# EAGLE design esp8266-rgb-ledstrip (EAGLE 7.2.0)
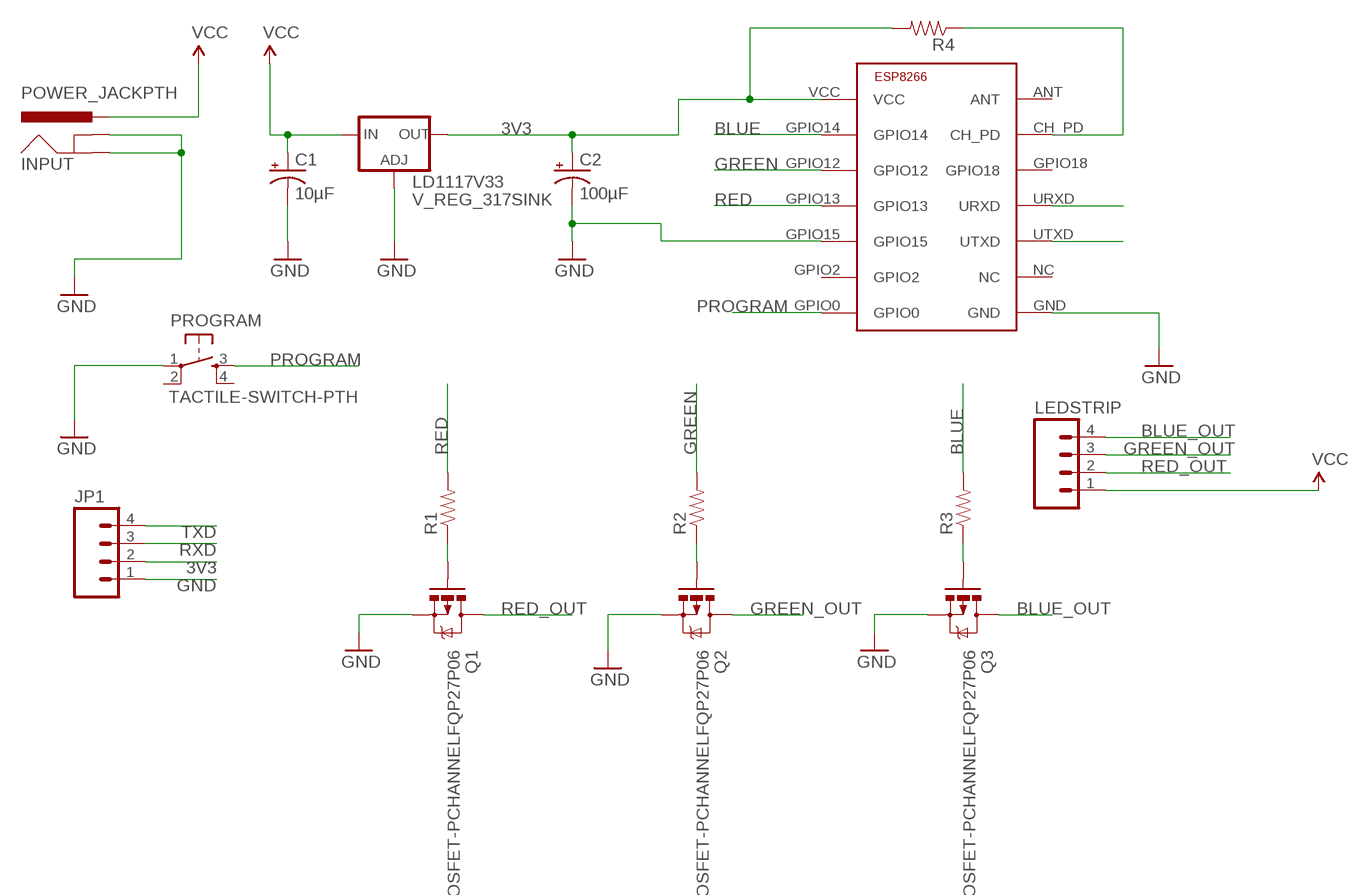
[diagram p0: schematic, sheet 1]

## Parts
C1  10µF  CAP_POLPTH2  [CPOL-RADIAL-10UF-25V]
C2  100µF  CAP_POLPTH1  [CPOL-RADIAL-100UF-25V]
INPUT  POWER_JACKPTH  [POWER_JACK_PTH]
JP1  M04PTH  [1X04]
LD1117V33  V_REG_317SINK  [TO220-ADJ]
LEDSTRIP  M04PTH  [1X04]
PROGRAM  TACTILE-SWITCH-PTH  [TAC-SWITCH-PTH]
Q1  MOSFET-PCHANNELFQP27P06  [TO220V]
Q2  MOSFET-PCHANNELFQP27P06  [TO220V]
Q3  MOSFET-PCHANNELFQP27P06  [TO220V]
R1  RESISTORAXIAL-0.3  [AXIAL-0.3]
R2  RESISTORAXIAL-0.3  [AXIAL-0.3]
R3  RESISTORAXIAL-0.3  [AXIAL-0.3]
R4  RESISTORAXIAL-0.3  [AXIAL-0.3]
U$1  ESP8266-03  [ESP-03]

## Nets
3V3: C2.1(+) JP1.2 LD1117V33.OUT R4.P$2 U$1.VCC
BLUE: R3.P$2 U$1.GPIO14
BLUE_OUT: LEDSTRIP.4 Q3.2(D)
BLUE_R: Q3.1(G) R3.P$1
GND: C1.2(-) C2.2(-) INPUT.GND INPUT.GNDBREAK JP1.1 LD1117V33.ADJ PROGRAM.1 Q1.3(S) Q2.3(S) Q3.3(S) U$1.GND U$1.GPIO15
GREEN: R2.P$2 U$1.GPIO12
GREEN_OUT: LEDSTRIP.3 Q2.2(D)
GREEN_R: Q2.1(G) R2.P$1
N$1: R4.P$1 U$1.CH_PD
PROGRAM: PROGRAM.3 U$1.GPIO0
RED: R1.P$2 U$1.GPIO13
RED_OUT: LEDSTRIP.2 Q1.2(D)
RED_R: Q1.1(G) R1.P$1
RXD: JP1.3 U$1.URXD
TXD: JP1.4 U$1.UTXD
VCC: C1.1(+) INPUT.PWR LD1117V33.IN LEDSTRIP.1
Unconnected: PROGRAM.2 PROGRAM.4 U$1.ANT U$1.GPIO2 U$1.GPIO18 U$1.NC

## Library data of the parts
C1 C2 = SparkFun-Capacitors:CAP_POL: Capacitor Polarized These are standard SMD and PTH capacitors. Normally 10uF, 47uF, and 100uF in electrolytic and tantalum varieties. Always verify the external diameter of the through hole cap, it varies with capacity, voltage, and manufacturer. The EIA devices should be standard.
INPUT = SparkFun-Connectors:POWER_JACK: Power Jack This is the standard 5.5mm barrel jack for power. The PTH is the most common, proven, reliable, footprint. The Slot footprint only works if the mill layer is transmitted to the PCB fab house so be warned. Mating wall wart : TOL-00298 (and others); PROD_ID: CONN-08197
JP1 LEDSTRIP = SparkFun-Connectors:M04: Header 4 Standard 4-pin 0.1" header. Use with straight break away headers (SKU : PRT-00116), right angle break away headers (PRT-00553), swiss pins (PRT-00743), machine pins (PRT-00117), and female headers (PRT-00115). Molex polarized connector foot print use with SKU : PRT-08231 with associated crimp pins and housings. 1MM SMD Version SKU: PRT-10208
LD1117V33 = SparkFun-PowerIC:V_REG_317: Voltage Regulator Standard LM317 adjustable voltage regulator. AOI (Adjust Output Input). Google 'LM317 Calculator' for easy to use app to get the two resistor values needed. 240/720 for 5V output. 240/390 for 3.3V output. Spark Fun Electronics SKU : COM-00527
PROGRAM = GeekAmmo:TACTILE-SWITCH: Tactile Switch 4 Pins, SPST NO
Q1-Q3 = SparkFun-DiscreteSemi:MOSFET-PCHANNEL: Generic PMOSFET IRLML2244 - TRANS-11153 (SOT-23 -20V -4.3A) (1.Gate 2.Source 3.Drain) FQP27P06 - COM-10349 <http://www.sparkfun.com/products/10349> (TO-220 -60V -27A) (1.Gate 2.Source 3.Drain)
R1-R4 = SparkFun-Passives:RESISTOR: Resistor Basic schematic elements and footprints for 0603, 1206, and PTH resistors.
U$1 = #ESP8266:ESP8266-03: ESP8266 - ESP-03 Module

## Board
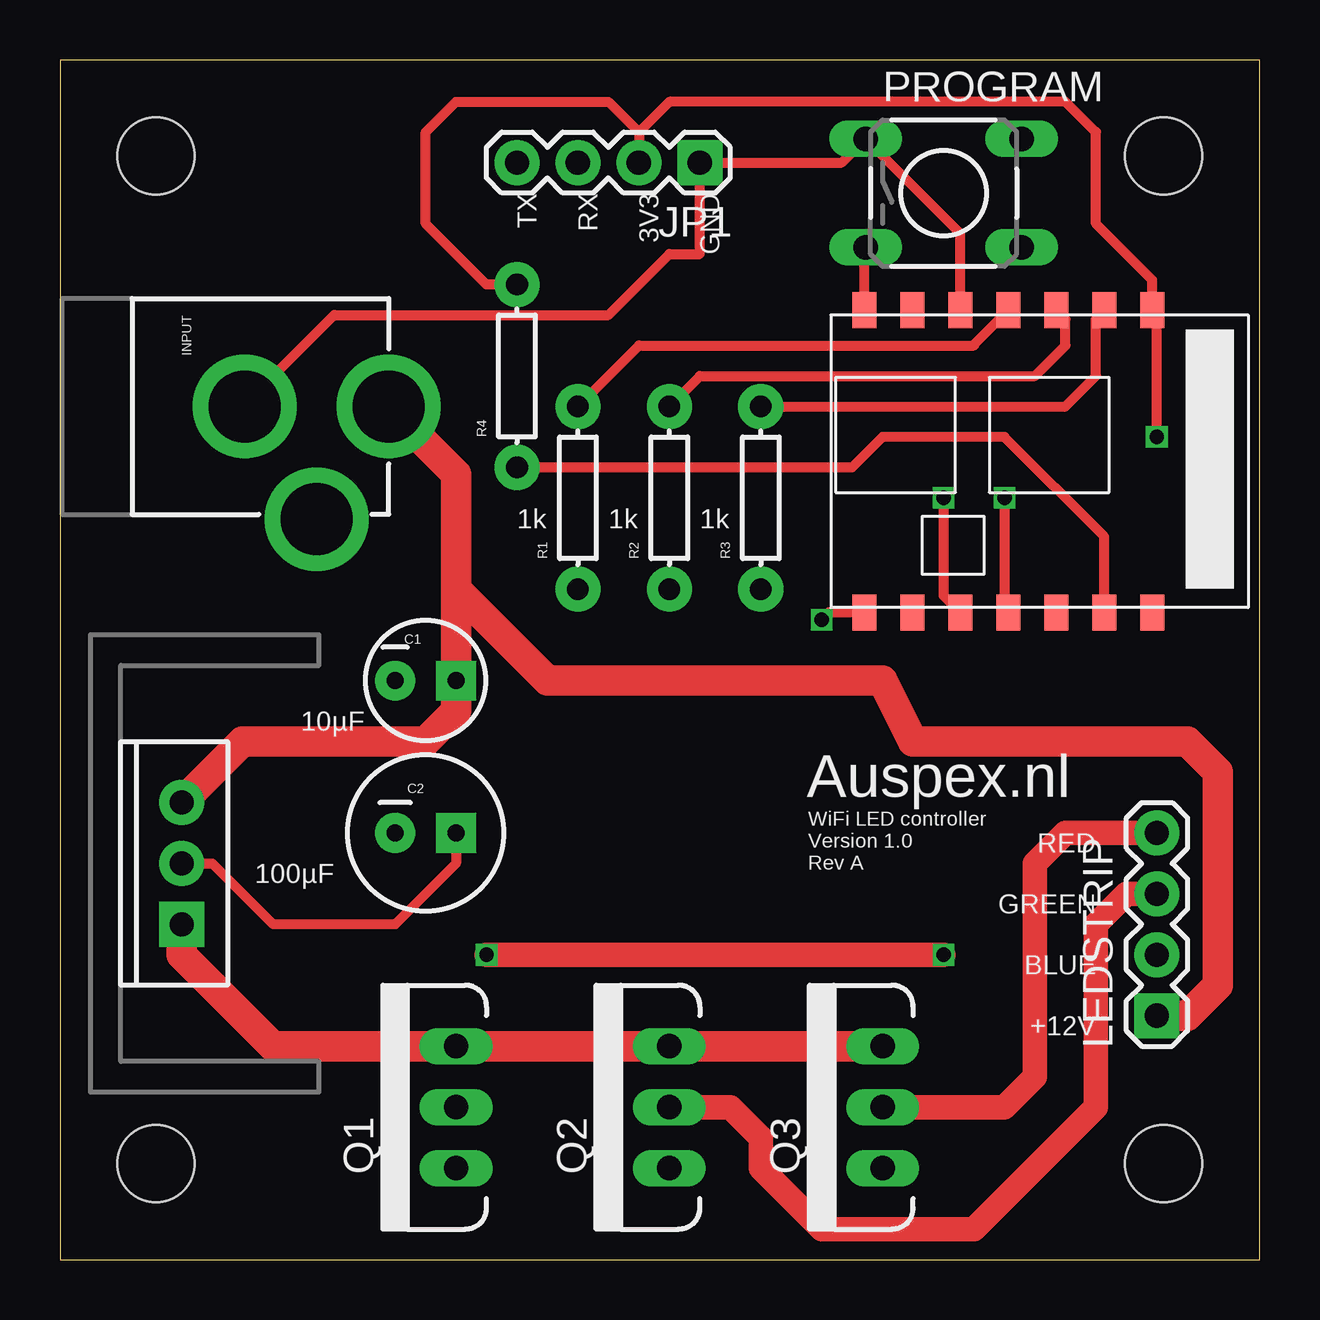
[diagram p1: board, top side]
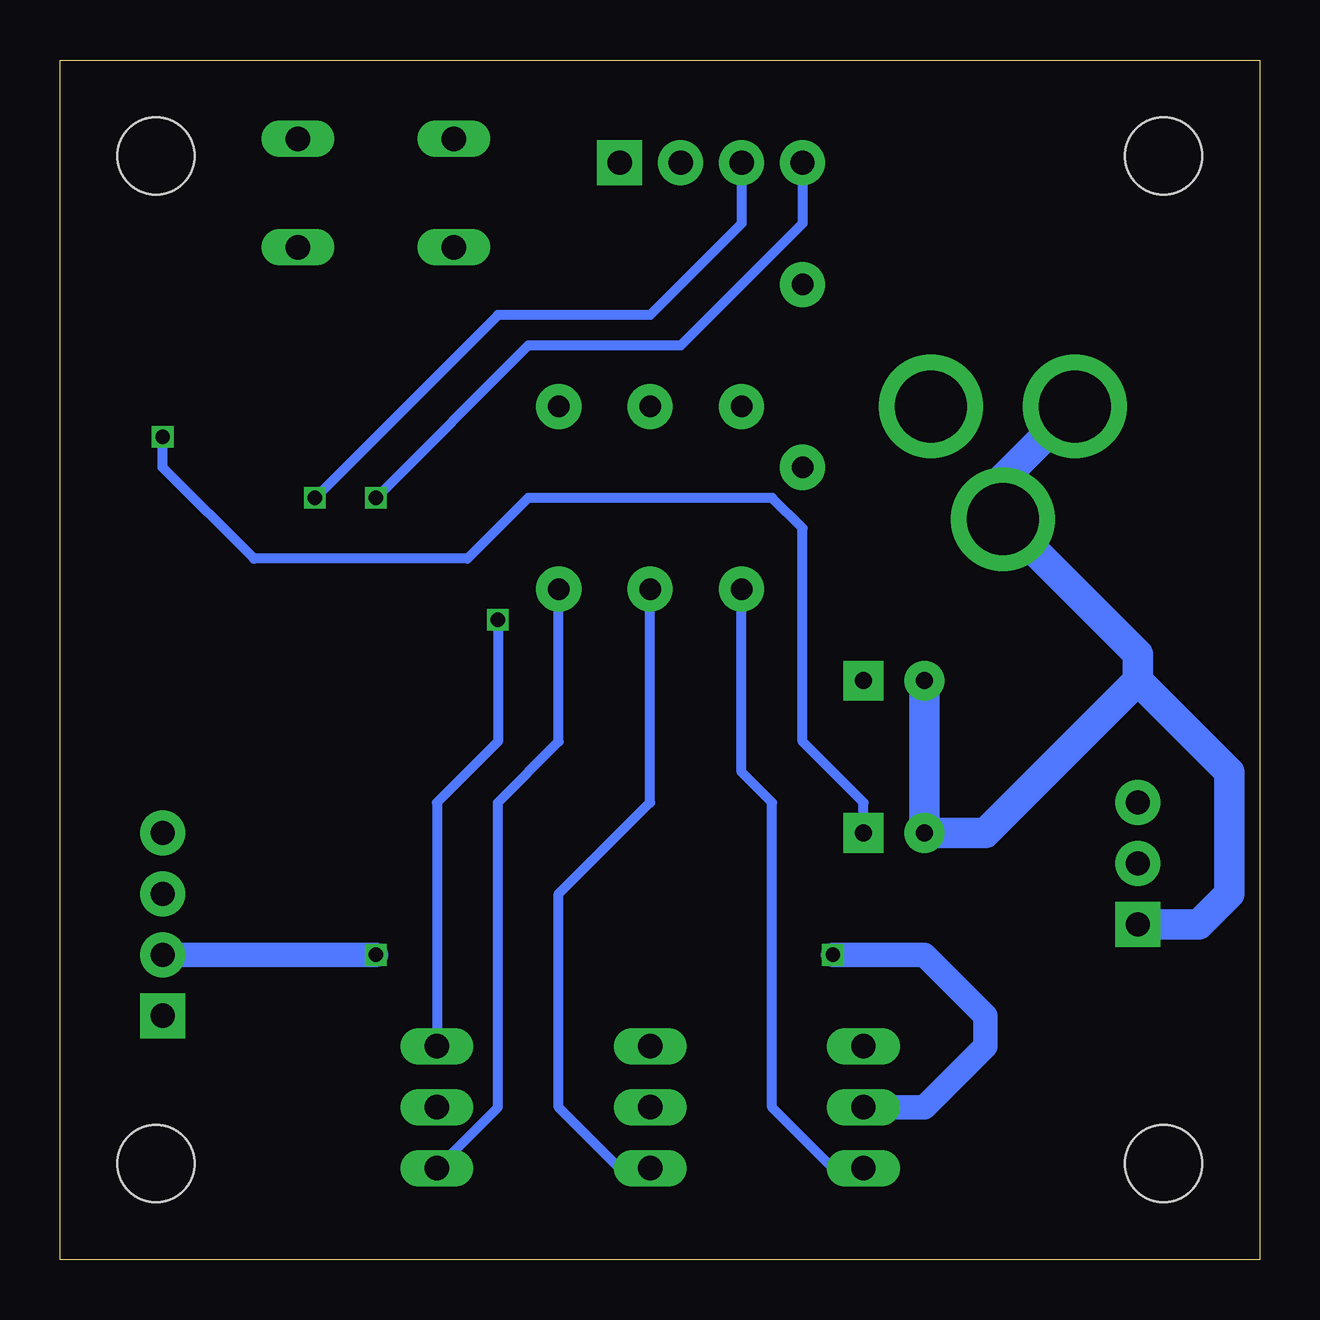
[diagram p2: board, bottom side, seen from below]

Size 50 x 50 mm. Coordinates in mm from the lower left corner, seen from the top.
Outline: 0,0 50,0 50,50 0,50 0,0
Copper layers (1*16): Top 0.035mm / dielectric 1.5mm / Bottom 0.035mm
Design rules "dirt_cheap_dirty_boards.v1": minimum track width 5mil, minimum drill 12mil, track to track 5mil, track to pad 5mil, pad to pad 5mil, via to via 5mil, smd to smd 0mil, copper to edge 10mil, drill to drill 10mil, minimum pad ring 10mil, minimum via ring 6mil, stop-mask expansion 2mil, vias tented up to drill 25mil, thermal gap 10mil
Holes 3.2 mm at 4,46 46,46 46,4 4,4

### Footprints (pad centres in the part's own frame; a part is rotated, then mirrored left to right if it is on the bottom)
CPOL-RADIAL-10UF-25V = drill 0.7 pad 1.651 square: 1 1.27,0 | drill 0.7 pad 1.651: 2 -1.27,0
CPOL-RADIAL-100UF-25V = drill 0.7 pad 1.651 square: 1 1.27,0 | drill 0.7 pad 1.651: 2 -1.27,0
POWER_JACK_PTH = drill 2.997 pad 4.318: GND 0,7.7; GNDBREAK 4.7,10.7; PWR 0,13.7
1X04 = drill 1.016 pad 1.88 square: 1 0,0 | drill 1.016 pad 1.88: 2 2.54,0; 3 5.08,0; 4 7.62,0
TO220-ADJ = drill 1 pad 1.88 square: ADJ -2.54,0 | drill 1 pad 1.88: IN 2.54,0; OUT 0,0
TAC-SWITCH-PTH = drill 1.016 pad 1.524 long: 1 -3.251,2.261; 2 3.251,2.261; 3 -3.251,-2.261; 4 3.251,-2.261
TO220V = drill 1.016 long: 1 -2.54,0; 2 0,0; 3 2.54,0
AXIAL-0.3 = drill 0.9 pad 1.88: P$1 -3.81,0; P$2 3.81,0
ESP-03 = smd 1 x 1.5: ANT 4,12.4; CH_PD 6,12.4; GND 16,12.4; GPIO0 16,-0.2; GPIO2 14,-0.2; GPIO12 8,-0.2; GPIO13 10,-0.2; GPIO14 6,-0.2; GPIO15 12,-0.2; GPIO18 8,12.4; NC 14,12.4; URXD 10,12.4; UTXD 12,12.4; VCC 4,-0.2

### Placement (x,y rotation side)
C1  15.24,24.13 0 top
C2  15.24,17.78 0 top
INPUT  0,35.56 270 top
JP1  26.67,45.72 180 top
LD1117V33  5.08,16.51 90 top
LEDSTRIP  45.72,10.16 90 top
PROGRAM  36.83,44.45 0 top
Q1  16.51,6.35 90 top
Q2  25.4,6.35 90 top
Q3  34.29,6.35 90 top
R1  21.59,31.75 90 top
R2  25.4,31.75 90 top
R3  29.21,31.75 90 top
R4  19.05,36.83 90 top
U$1  49.53,39.37 180 top

### Tracks (layer width: path | path; a pad name or v marks a point on that pad's centre or on a via)
3V3  (via drill 0.6)
  Top 0.406: LD1117V33.OUT 6.35,16.51 8.89,13.97 13.97,13.97 16.51,16.51 C2.1 | 24.13,46.99 25.4,48.26 41.91,48.26 43.18,46.99 43.18,43.18 45.53,40.83 U$1.VCC 45.72,39.38 v45.72,34.29 | 24.13,46.99 JP1.2 | R4.P$2 17.78,40.64 15.24,43.18 15.24,46.99 16.51,48.26 22.86,48.26 24.13,46.99
  Bottom 0.406: C2.1 16.51,19.05 19.05,21.59 19.05,30.48 20.32,31.75 30.48,31.75 33.02,29.21 41.91,29.21 45.72,33.02 v45.72,34.29
BLUE
  Top 0.406: R3.P$2 41.91,35.56 43.18,36.83 43.18,39.22 U$1.GPIO14
BLUE_OUT
  Top 1.016: Q3.2 39.37,6.35 40.64,7.62 40.64,16.51 41.91,17.78 LEDSTRIP.4
BLUE_R
  Bottom 0.406: Q3.1 31.75,6.35 31.75,19.05 29.21,21.59 R3.P$1
GND  (via drill 0.6)
  Top 0.406: U$1.GPIO15 37.53,42.76 PROGRAM.1 32.59,45.72 JP1.1 26.67,41.91 25.4,41.91 22.86,39.37 11.43,39.37 7.7,35.64 INPUT.GND | U$1.GND 32.05,26.97 v31.75,26.67
  Top 1.27: LD1117V33.ADJ 5.08,12.7 8.89,8.89 Q1.3 Q2.3 Q3.3
  Bottom 0.406: v31.75,26.67 31.75,21.59 34.29,19.05 Q3.3
  Bottom 1.27: C1.2 C2.2 11.43,17.78 5.08,24.13 | 5.08,24.13 1.27,20.32 1.27,15.24 2.54,13.97 LD1117V33.ADJ | 5.08,24.13 5.08,25.24 INPUT.GNDBREAK 10.7,32.56 INPUT.GND
GREEN
  Top 0.406: R2.P$2 26.67,36.83 40.64,36.83 41.91,38.1 41.91,39.19 U$1.GPIO12
GREEN_OUT
  Top 1.016: LEDSTRIP.3 44.45,15.24 43.18,13.97 43.18,6.35 38.1,1.27 31.75,1.27 29.21,3.81 29.21,5.08 27.94,6.35 Q2.2
GREEN_R
  Bottom 0.406: Q2.1 26.67,3.81 29.21,6.35 29.21,15.24 25.4,19.05 R2.P$1
N$1
  Top 0.406: U$1.CH_PD 43.53,30.13 39.37,34.29 34.29,34.29 33.02,33.02 R4.P$1
PROGRAM
  Top 0.406: U$1.GPIO0 33.53,42.14 PROGRAM.3
RED
  Top 0.406: R1.P$2 24.13,38.1 38.1,38.1 38.1,38.14 U$1.GPIO13
RED_OUT  (via drill 0.6)
  Top 1.016: v36.83,12.7 v17.78,12.7
  Bottom 1.016: Q1.2 13.97,6.35 11.43,8.89 11.43,10.16 13.97,12.7 v17.78,12.7 | LEDSTRIP.2 v36.83,12.7
RED_R
  Bottom 0.406: Q1.1 17.78,3.81 20.32,6.35 20.32,19.05 21.59,20.32 R1.P$1
RXD  (via drill 0.6)
  Top 0.406: v39.37,31.75 39.37,27.13 U$1.URXD
  Bottom 0.406: JP1.3 21.59,43.18 25.4,39.37 31.75,39.37 v39.37,31.75
TXD  (via drill 0.6)
  Top 0.406: v36.83,31.75 36.83,27.67 U$1.UTXD
  Bottom 0.406: JP1.4 19.05,43.18 24.13,38.1 30.48,38.1 v36.83,31.75
VCC
  Top 1.27: LD1117V33.IN 7.62,21.59 15.24,21.59 16.51,22.86 C1.1 16.51,27.94 | 16.51,27.94 16.51,32.75 INPUT.PWR | LEDSTRIP.1 46.99,10.16 48.26,11.43 48.26,20.32 46.99,21.59 35.56,21.59 34.29,24.13 20.32,24.13 16.51,27.94

### Text on the board
tPlace: TX | RX | 3V3 | GND | 1k | 1k | 1k | 10µF | Auspex.nl | RED | 100µF | WiFi LED controller / Version 1.0 / Rev A | GREEN | BLUE | +12V